# EasyEDA Pro project brainmodule1.epro, board PCB
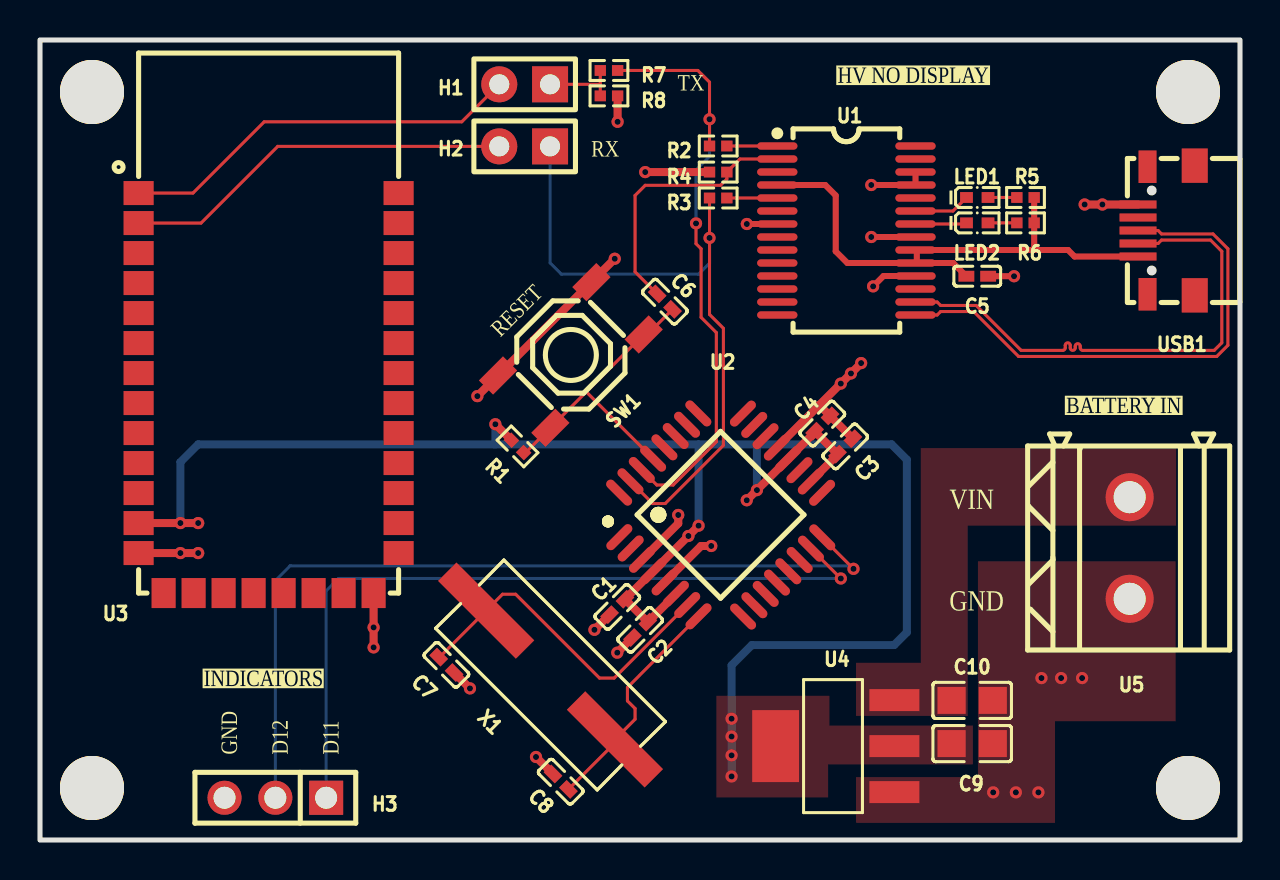
[diagram p2: board, top side]
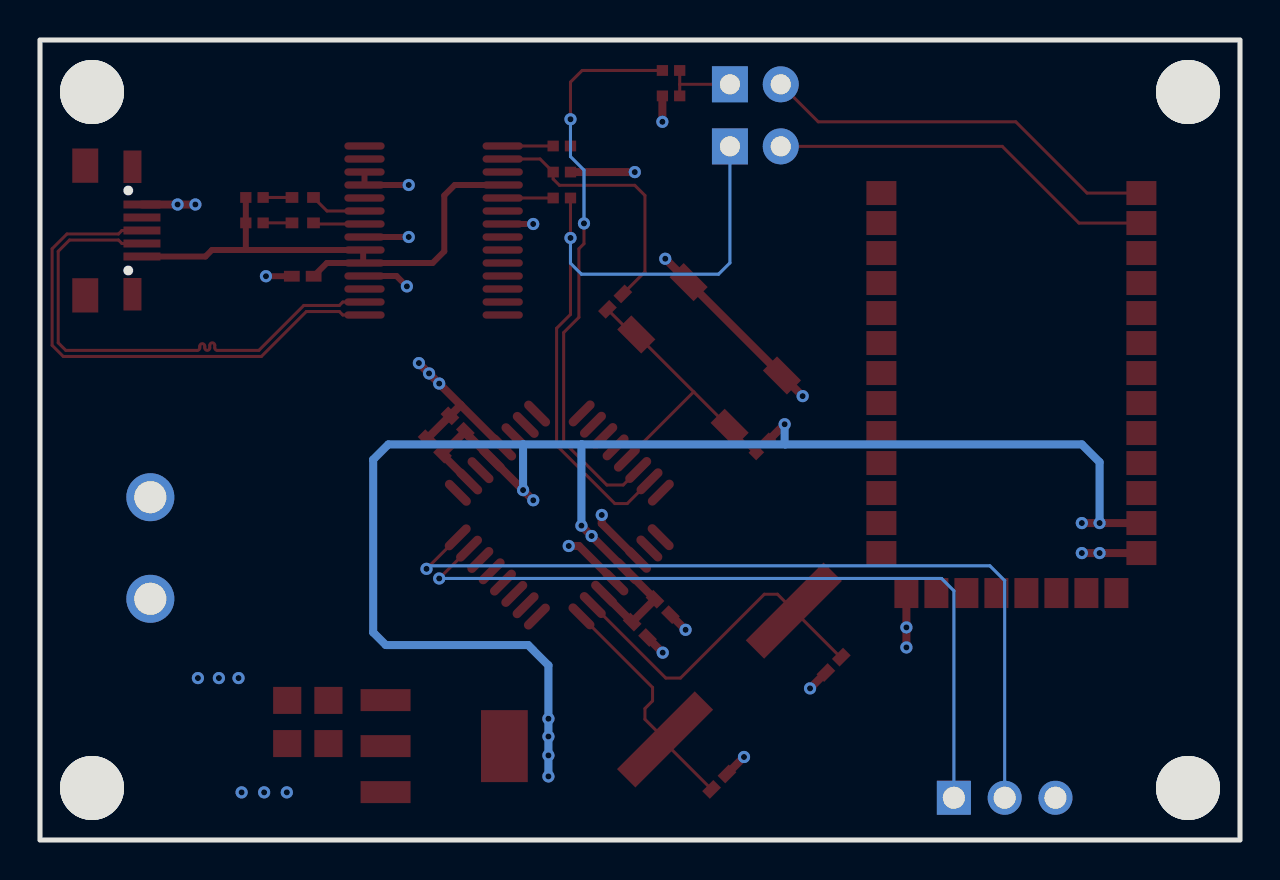
[diagram p3: board, bottom side, seen from below]

Outline 60 x 40 mm; copper layers: Top Layer, Bottom Layer. Coordinates in mm from the lower left corner of the outline.
Outline path: rectangle 0,40 60,0
Stack: Top Layer 0.035mm / Dielectric1 1.51mm FR4 er 4.5 / Bottom Layer 0.035mm

## Design rules (mm)
net D-: DP1
net D+: DP1
template: Custom Config
spacing copperThickness1oz (default): track to track 0.102, other pairs 0.152 to 0.3
spacing copperThickness2oz: track to track 0.203, other pairs 0.152 to 0.3
track width copperThickness1oz (default): min 0.127, default 0.254, max 2.54
track width copperThickness2oz: min 0.203, default 0.254, max 2.54
differential pair differentialPair (default): width min 0.127, default 0.254, max 2.54; gap min 0.152, default 0.152
via viaSize (default): diameter min 0.5, default 0.6, max 10; hole min 0.3, default 0.3, max 6.3

## Placement (name value [footprint] x y rotation side)
C1  100nF  [C0402]  28.86 11.65 45 top
C2  100nF  [C0402]  30.01 10.51 45 top
C3  100nF  [C0402]  40.26 19.68 225 top
C4  100nF  [C0402]  39.12 20.82 225 top
C5  100nF  [C0402]  46.86 28.19 180 top
C6  100nF  [C0402]  31.24 26.92 315 top
C7  22pF  [C0402]  20.32 8.76 135 top
C8  22pF  [C0402]  26.03 2.92 315 top
C9  22uF  [C0805]  46.61 4.82 180 top
C10  22uF  [C0805]  46.61 6.98 180 top
H1  -  [HDR-TH_2P-P2.54-V-M-1]  24.23 37.78 180 top
H2  -  [HDR-TH_2P-P2.54-V-M-1]  24.23 34.68 180 top
H3  -  [HDR-TH_3P-P2.54-V-M]  11.77 2.11 180 top
LED1  TJ-S1005SW4TGLC2R-A5  [LED0402-RD]  46.86 32.13 0 top
LED2  TJ-S1005SW4TGLC2R-A5  [LED0402-RD]  46.86 30.86 0 top
R1  10kΩ  [R0402]  23.88 19.68 135 top
R2  1kΩ  [R0402]  33.91 34.7 180 top
R3  1kΩ  [R0402]  33.91 32.1 180 top
R4  1kΩ  [R0402]  33.91 33.4 180 top
R5  1kΩ  [R0402]  49.28 32.13 0 top
R6  1kΩ  [R0402]  49.28 30.86 0 top
R7  1kΩ  [R0402]  28.45 38.48 0 top
R8  2kΩ  [R0402]  28.45 37.21 180 top
SCREW1  -  [Screw-Hole-M3]  2.66 37.34 0 top
SCREW2  -  [Screw-Hole-M3]  57.46 37.34 0 top
SCREW3  -  [Screw-Hole-M3]  2.66 2.54 0 top
SCREW4  -  [Screw-Hole-M3]  57.46 2.54 0 top
SW1  TS-1187A-B-A-B  [SW-SMD_4P-L5.1-W5.1-P3.70-LS6.5-TL-2]  26.54 24.25 225 top
U1  FT232RL-REEL  [SSOP-28_L10.2-W5.3-P0.65-LS7.8-BL]  40.32 30.47 270 top
U2  ATMEGA328P-AU  [TQFP-32_L7.0-W7.0-P0.80-LS9.0-BL]  34.04 16.25 315 top
U3  -  [BULETM-SMD_HC-05]  11.43 22.35 0 top
U4  AMS1117-3.3  [SOT-223-3_L6.5-W3.4-P2.30-LS7.0-BR]  39.75 4.69 0 top
U5  BATTERY IN  [CONN-TH_2P-P5.08_DB128L-5.08-2P]  54.48 14.6 270 top
USB1  MICRO QTZB5.0  [MICRO-USB-SMD_MICRO-QTZB5.0]  56.32 30.47 90 top
X1  16MHz  [HC-49S_L11.4-W4.8]  25.53 8.25 315 top

## Footprints (pads in the part's own frame, mm; a bottom-side part is the same pattern mirrored in y, then rotated)
BULETM-SMD_HC-05
  rect 1.5x1.2 smd: 1(-6.5,10) 2(-6.5,8.5) 3(-6.5,7) 4(-6.5,5.5) 5(-6.5,4) 6(-6.5,2.5) 7(-6.5,1) 8(-6.5,-0.5) 9(-6.5,-2) 10(-6.5,-3.5) 11(-6.5,-5) 12(-6.5,-6.5) 13(-6.5,-8) 22(6.5,-8) 23(6.5,-6.5) 24(6.5,-5) 25(6.5,-3.5) 26(6.5,-2) 27(6.5,-0.5) 28(6.5,1) 29(6.5,2.5) 30(6.5,4) 31(6.5,5.5) 32(6.5,7) 33(6.5,8.5) 34(6.5,10)
  rect 1.2x1.5 smd: 14(-5.25,-10) 15(-3.75,-10) 16(-2.25,-10) 17(-0.75,-10) 18(0.75,-10) 19(2.25,-10) 20(3.75,-10) 21(5.25,-10)
C0402
  rect 0.79x0.54 smd: 1(-0.545,0) 2(0.545,0)
C0805
  rect 1.41x1.35 smd: 1(-1.03,0) 2(1.03,0)
CONN-TH_2P-P5.08_DB128L-5.08-2P
  round 2.4 hole 1.6: 1(-2.54,0) 2(2.54,0)
HC-49S_L11.4-W4.8
  rect 5.5x1.3 smd: 1(-4.553,0) 2(4.553,0)
HDR-TH_2P-P2.54-V-M-1
  rect 1.8x1.8 hole 1: 1(-1.27,0)
  round 1.8 hole 1: 2(1.27,0)
HDR-TH_3P-P2.54-V-M
  rect 1.7x1.7 hole 1.1: 1(-2.54,0)
  round 1.7 hole 1.1: 2(0,0) 3(2.54,0)
LED0402-RD
  rect 0.636x0.54 smd: 1(-0.538,0) 2(0.538,0)
MICRO-USB-SMD_MICRO-QTZB5.0
  rect 0.4x1.85 smd: 1(-1.3,1.417) 2(-0.65,1.417) 3(0,1.417) 4(0.65,1.417) 5(1.3,1.417)
  rect 1.715x1.3 smd: 6(-3.243,-1.417) 6(3.243,-1.417)
  rect 1.625x0.9 smd: 6(-3.188,0.943) 6(3.188,0.943)
R0402
  rect 0.566x0.54 smd: 1(-0.433,0) 2(0.433,0)
Screw-Hole-M3
  round 3.2 hole 3.2: 1(-0.064,0.064)
SOT-223-3_L6.5-W3.4-P2.30-LS7.0-BR
  rect 2.5x1.1 smd: 1(2.97,-2.3) 2(2.97,0) 3(2.97,2.3)
  rect 2.34x3.6 smd: 4(-2.97,0)
SSOP-28_L10.2-W5.3-P0.65-LS7.8-BL
  oval 0.364x2.015 smd: 1(-4.225,-3.455) 2(-3.575,-3.455) 3(-2.925,-3.455) 4(-2.275,-3.455) 5(-1.625,-3.455) 6(-0.975,-3.455) 7(-0.325,-3.455) 8(0.325,-3.455) 9(0.975,-3.455) 10(1.625,-3.455) 11(2.275,-3.455) 12(2.925,-3.455) 13(3.575,-3.455) 14(4.225,-3.455) 15(4.225,3.455) 16(3.575,3.455) 17(2.925,3.455) 18(2.275,3.455) 19(1.625,3.455) 20(0.975,3.455) 21(0.325,3.455) 22(-0.325,3.455) 23(-0.975,3.455) 24(-1.625,3.455) 25(-2.275,3.455) 26(-2.925,3.455) 27(-3.575,3.455) 28(-4.225,3.455)
SW-SMD_4P-L5.1-W5.1-P3.70-LS6.5-TL-2
  rect 1.7x1 smd: 1(-3.3,1.85) 2(3.3,1.85) 3(-3.3,-1.85) 4(3.3,-1.85)
TQFP-32_L7.0-W7.0-P0.80-LS9.0-BL
  oval 0.45x1.65 smd: 1(-2.8,-4.369) 2(-2,-4.369) 3(-1.2,-4.369) 4(-0.4,-4.369) 5(0.4,-4.369) 6(1.2,-4.369) 7(2,-4.369) 8(2.8,-4.369) 17(2.8,4.369) 18(2,4.369) 19(1.2,4.369) 20(0.4,4.369) 21(-0.4,4.369) 22(-1.2,4.369) 23(-2,4.369) 24(-2.8,4.369)
  oval 1.65x0.45 smd: 9(4.381,-2.8) 10(4.381,-2) 11(4.381,-1.2) 12(4.381,-0.4) 13(4.381,0.4) 14(4.381,1.2) 15(4.381,2) 16(4.381,2.8) 25(-4.381,2.8) 26(-4.381,2) 27(-4.381,1.2) 28(-4.381,0.4) 29(-4.381,-0.4) 30(-4.381,-1.2) 31(-4.381,-2) 32(-4.381,-2.8)

## Nets
As in the schematic.

Pads without a net: SCREW1 1; SCREW2 1; SCREW3 1; SCREW4 1; U1 3 6 8 9 10 11 12 13 14 17 24 27 28; U2 1 2 9 10 11 12 13 14 17 19 22 23 24 25 26 32; U3 3 4 5 6 7 8 9 10 11 14 15 16 17 18 19 20 22 23 24 25 26 27 28 29 30 31 32 33 34; USB1 4 6

## Via types
v1: diameter 0.61, hole 0.305, Top Layer to Bottom Layer, 46 vias

## Routing (per net, layer and track width the routed paths; a pad name or vN(x,y) marks a point on that pad's centre or on a via; arc(x,y) is an arc through that point)
GND: length 51.7
  Top Layer w0.3: v1(41.56,32.75) U1.25 U1.26 ; U1.21 v1(41.56,30.15) ; C5.1 v1(48.7,28.19) ; v1(41.66,27.68) 42.18,28.2 U1.18 ; U1.7 v1(35.34,30.8)
  Top Layer w0.4: U3.21 v1(16.68,10.63) v1(16.68,9.63) ; C1.1 v1(27.72,10.51) ; v1(41.06,23.84) 41.06,23.84 v1(40.55,23.33) v1(40.04,22.82) 38.97,21.75 ; U2.21 38.97,21.75 ; 38.97,21.75 38.97,21.74 C4.1 C3.1 ; v1(52.23,31.78) v1(53.12,31.78) 54.9,31.78 ; R4.2 v1(30.26,33.4) ; v1(21.87,22.19) SW1.3 v1(28.74,29.06) ; R8.1 v1(28.88,35.91) ; U3.13 v1(7.02,14.35) v1(7.91,14.35) ; 31.23,12.88 33.05,14.7 v1(33.56,14.7) ; C8.1 v1(24.8,4.15) ; 31.91,16.22 31.91,15.82 U2.3 ; C7.1 v1(21.5,7.58) ; C2.1 v1(28.86,9.37)
  vias: v1(31.91,16.25) v1(47.66,2.38) v1(48.79,2.38) v1(49.92,2.38) v1(50.07,8.1) v1(51.06,8.1) v1(52.1,8.1)
VBUS: length 27.5
  Top Layer w0.152: U1.20 43.84,29.5 43.84,29.43
  Top Layer w0.3: C5.2 45.66,28.85 U1.19 ; U1.19 40.37,28.85 39.79,29.43 39.79,32.23 39.26,32.75 U1.4 ; U1.19 43.84,28.92 43.84,29.43 ; 43.84,29.5 51.4,29.5 51.73,29.17 USB1.1 ; 49.71,29.5 R6.2 R5.2
VCC: length 92.4
  Top Layer w0.152: C4.2 38.73,20.38
  Top Layer w0.4: v1(35.34,16.99) v1(35.85,17.5) U2.20 38.73,20.38 38.79,20.38 C3.2 39.87,19.26 U2.18 ; U3.12 v1(7.02,15.85) v1(7.91,15.85) ; U2.6 31.8,12.3 C2.2 C1.2 30.66,13.44 U2.4 v1(32.42,15.2) 32.93,15.71 v1(32.93,15.72) ; R1.2 v1(22.77,20.79)
  Bottom Layer w0.4: 35.85,19.78 32.92,19.78 ; 35.85,19.78 42.58,19.78 43.34,19.02 43.34,10.38 42.71,9.75 35.59,9.75 34.58,8.73 v1(34.58,6.06) v1(34.58,5.17) v1(34.58,4.23) v1(34.58,3.18) ; 35.85,19.78 35.85,19.78 v1(35.85,17.5) ; 32.92,19.78 22.75,19.78 ; 32.92,19.78 32.93,19.77 v1(32.93,15.72) ; 22.75,19.78 7.91,19.78 7.02,18.89 v1(7.02,15.85) ; 22.75,19.78 22.77,19.8 v1(22.77,20.79)
D11: length 38.4
  Top Layer w0.152: U2.15 v1(40.04,13.08)
  Bottom Layer w0.152: H3.1 14.31,12.46 14.92,13.08 v1(40.04,13.08)
D12: length 42.4
  Top Layer w0.152: v1(40.68,13.56) 39.11,15.12 U2.16
  Bottom Layer w0.152: H3.2 11.77,12.97 12.51,13.71 40.52,13.71 v1(40.68,13.56)
D+: length 26.5
  Top Layer w0.152: U1.15 44.86,26.25 45.03,26.42 46.68,26.42 48.93,24.18 58.84,24.18 59.39,24.73 59.39,29.56 58.65,30.3 56.08,30.3 55.9,30.47 USB1.3
D-: length 26.5
  Top Layer w0.152: U1.16 44.86,26.9 45.03,26.73 46.81,26.73 49.06,24.48 51.14,24.48 arc(51.22,24.52) 51.26,24.61 51.26,24.74 arc(51.39,24.86) 51.51,24.74 51.51,24.61 arc(51.64,24.48) 51.76,24.61 51.76,24.69 arc(51.89,24.82) 52.01,24.69 52.01,24.61 arc(52.05,24.52) 52.14,24.48 58.71,24.48 59.09,24.86 59.09,29.43 58.53,30 56.08,30 55.9,29.83 USB1.2
DTR: length 13.4
  Top Layer w0.152: U1.2 35,34.05 R4.1 34.34,33.05 34.03,32.73 30.26,32.73 29.75,32.23 29.75,28.41 C6.1
RESET: length 15.1
  Top Layer w0.152: C6.2 30.37,25.28 30.18,25.28 27.3,22.4 ; 27.3,22.4 27.32,22.4 30.66,19.07 ; 27.3,22.4 SW1.2 24.28,19.37 R1.1
RX: length 34.5
  Top Layer w0.152: R3.2 v1(33.48,30.1) 33.48,26.28 34.17,25.58 34.17,19.73 31.26,16.82 30.64,16.82 29.52,17.94
  Bottom Layer w0.152: v1(33.48,30.1) 33.48,28.84 32.93,28.29 26.07,28.29 25.5,28.86 H2.1
TX: length 29.8
  Top Layer w0.152: R2.2 v1(33.48,36.04) 33.48,37.89 32.89,38.48 R7.2 ; v1(32.8,30.83) 32.8,29.81 33.06,29.56 33.06,26.13 33.82,25.37 33.82,19.91 31.66,17.75 30.84,17.75 U2.30
  Bottom Layer w0.152: v1(32.8,30.83) 32.8,33.5 33.48,34.17 v1(33.48,36.04)
XTAL1: length 17
  Top Layer w0.152: U2.7 28.71,8.1 27.97,8.1 23.78,12.29 23.13,12.29 X1.1 19.98,9.14 C7.2
XTAL2: length 11.7
  Top Layer w0.152: C8.2 28.75,4.86 X1.2 29.75,6.04 29.75,6.57 29.37,6.95 29.37,7.63 U2.8
$1N2642: length 2.5
  Top Layer w0.152: R2.1 U1.1
$1N2643: length 2.5
  Top Layer w0.152: U1.5 R3.1
$1N2655: length 2.8
  Top Layer w0.152: U1.23 45.65,31.45 LED1.1
$1N2656: length 2.6
  Top Layer w0.152: LED2.1 46.27,30.8 U1.22
$1N2657: length 1.4
  Top Layer w0.152: LED1.2 R5.1
$1N2658: length 1.4
  Top Layer w0.152: LED2.2 R6.1
$1N2690: length 20.3
  Top Layer w0.152: H1.2 21.09,35.91 11.21,35.91 7.65,32.35 U3.1
$1N2691: length 19.6
  Top Layer w0.152: H2.2 11.89,34.68 8.05,30.85 U3.2
$1N2692: length 3.8
  Top Layer w0.152: 28.01,37.78 28.01,37.78 H1.1 ; 28.01,37.78 R7.1 ; 28.01,37.78 R8.2

## Copper pours and planes (outline as drawn; the poured copper is in the pictures)
GND on Top Layer: 40.8,13.94 56.78,13.94 56.78,0.86 40.8,0.86
GND on Bottom Layer: 0,40 60,40 60,0 0,0
VCC on Top Layer: 33.82,7.21 46.64,7.21 46.64,2.13 33.82,2.13
$1N3876 on Top Layer: 40.8,19.59 56.8,19.59 56.8,6.2 40.8,6.2

## Text on the board
Top Silkscreen Layer: INDICATORS | RX | TX | HV NO DISPLAY | BATTERY IN | RESET | GND | D12 | D11 | VIN
